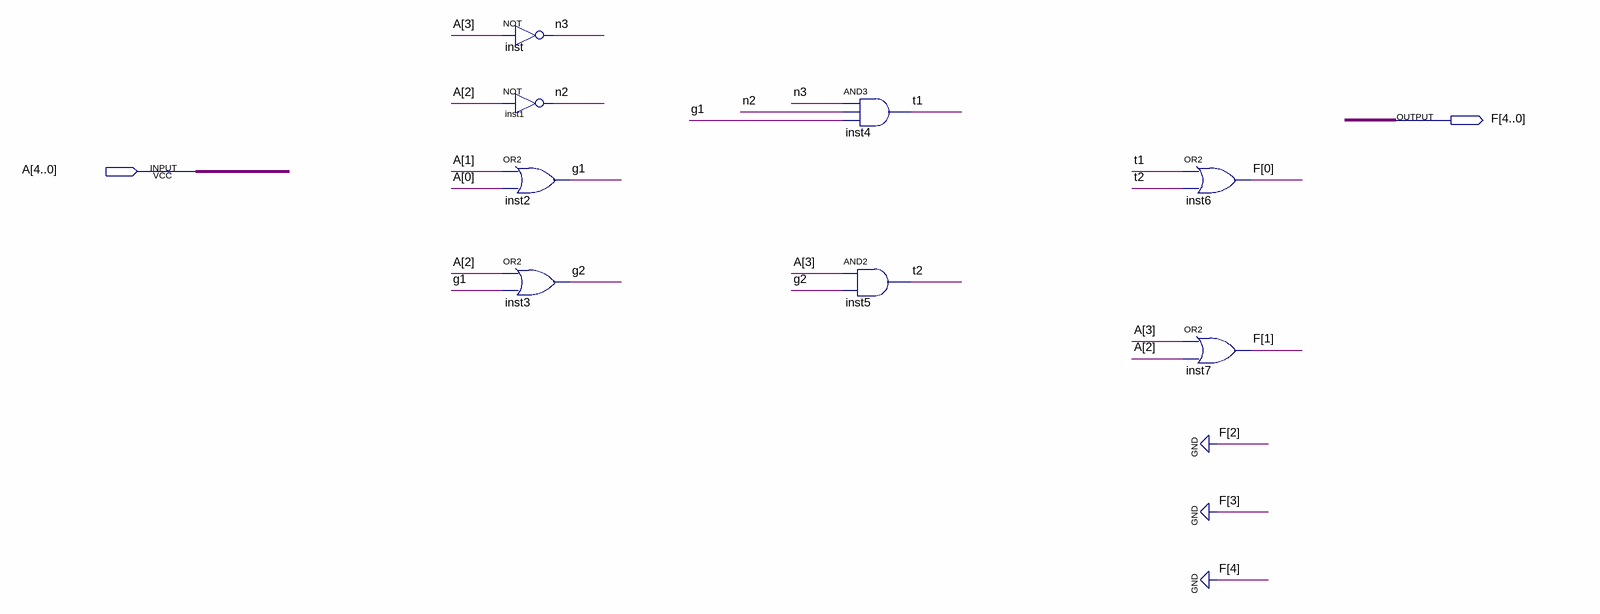
[diagram p0: schematic sheet]
// Quartus schematic raiz_a.bdf as structural Verilog: 8 symbols, 2 pins
module raiz_a (
  input  [4:0] A,
  output [4:0] F
);

  wire g1, g2, n2, n3, t1, t2;

  not inst (n3, A[3]);
  not inst1 (n2, A[2]);
  or inst2 (g1, A[1], A[0]);
  or inst3 (g2, A[2], g1);
  and inst4 (t1, n3, n2, g1);
  and inst5 (t2, A[3], g2);
  or inst6 (F[0], t1, t2);
  or inst7 (F[1], A[3], A[2]);

  assign F[4:2] = 3'b000;
endmodule
